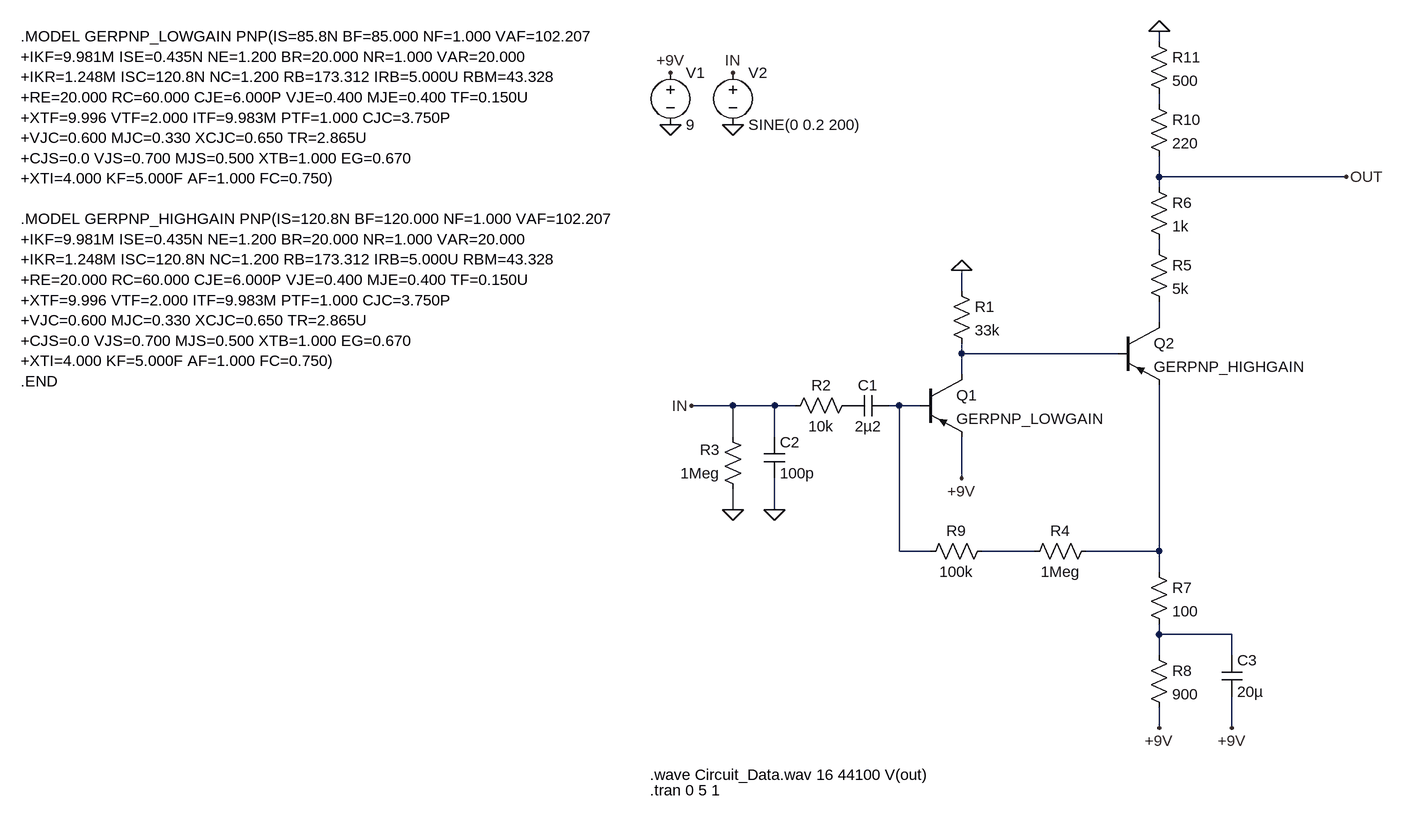
[diagram p0: schematic PNP_Fuzz_Simulation_wav_out.asc]
PNP_Fuzz_Simulation_wav_out.asc, the LTspice schematic file:
Version 4
SHEET 1 1636 1104
WIRE 496 -320 496 -336
WIRE 496 -224 496 -240
WIRE 496 -112 496 -144
WIRE 784 -112 496 -112
WIRE 496 -96 496 -112
WIRE 496 0 496 -16
WIRE 192 64 192 32
WIRE 496 112 496 80
WIRE 192 160 192 144
WIRE 432 160 192 160
WIRE 192 192 192 160
WIRE -160 240 -224 240
WIRE -96 240 -160 240
WIRE -64 240 -96 240
WIRE 96 240 80 240
WIRE 128 240 96 240
WIRE -160 288 -160 240
WIRE -96 288 -96 240
WIRE 192 352 192 288
WIRE -160 400 -160 368
WIRE -96 400 -96 352
WIRE 96 464 96 240
WIRE 144 464 96 464
WIRE 304 464 224 464
WIRE 496 464 496 208
WIRE 496 464 384 464
WIRE 496 496 496 464
WIRE 496 592 496 576
WIRE 608 592 496 592
WIRE 496 624 496 592
WIRE 608 624 608 592
WIRE 496 736 496 704
WIRE 608 736 608 688
FLAG 192 32 0
FLAG -224 240 IN
FLAG 192 352 +9V
FLAG -160 400 0
FLAG -256 -192 0
FLAG -160 -192 0
FLAG -256 -272 +9V
FLAG -160 -272 IN
FLAG -96 400 0
FLAG 496 736 +9V
FLAG 608 736 +9V
FLAG 784 -112 OUT
FLAG 496 -336 0
SYMBOL res 176 48 R0
SYMATTR InstName R1
SYMATTR Value 33k
SYMBOL res 32 224 R90
WINDOW 0 0 56 VBottom 2
WINDOW 3 32 56 VTop 2
SYMATTR InstName R2
SYMATTR Value 10k
SYMBOL res -144 384 R180
WINDOW 0 36 76 Left 2
WINDOW 3 36 40 Left 2
SYMATTR InstName R3
SYMATTR Value 1Meg
SYMBOL voltage -256 -288 R0
WINDOW 123 0 0 Left 0
WINDOW 39 0 0 Left 0
SYMATTR InstName V1
SYMATTR Value 9
SYMBOL voltage -160 -288 R0
WINDOW 123 0 0 Left 0
WINDOW 39 0 0 Left 0
SYMATTR InstName V2
SYMATTR Value SINE(0 0.2 200)
SYMBOL pnp 128 192 R0
SYMATTR InstName Q1
SYMATTR Value GERPNP_LOWGAIN
SYMBOL cap 80 224 R90
WINDOW 0 0 32 VBottom 2
WINDOW 3 32 32 VTop 2
SYMATTR InstName C1
SYMATTR Value 2µ2
SYMBOL cap -112 288 R0
SYMATTR InstName C2
SYMATTR Value 100p
SYMBOL res 400 448 R90
WINDOW 0 0 56 VBottom 2
WINDOW 3 32 56 VTop 2
SYMATTR InstName R4
SYMATTR Value 1Meg
SYMBOL res 480 -16 R0
SYMATTR InstName R5
SYMATTR Value 5k
SYMBOL res 480 -112 R0
SYMATTR InstName R6
SYMATTR Value 1k
SYMBOL res 480 480 R0
SYMATTR InstName R7
SYMATTR Value 100
SYMBOL res 480 608 R0
SYMATTR InstName R8
SYMATTR Value 900
SYMBOL cap 592 624 R0
SYMATTR InstName C3
SYMATTR Value 20µ
SYMBOL res 240 448 R90
WINDOW 0 0 56 VBottom 2
WINDOW 3 32 56 VTop 2
SYMATTR InstName R9
SYMATTR Value 100k
SYMBOL res 480 -240 R0
SYMATTR InstName R10
SYMATTR Value 220
SYMBOL res 480 -336 R0
SYMATTR InstName R11
SYMATTR Value 500
SYMBOL pnp 432 112 R0
SYMATTR InstName Q2
SYMATTR Value GERPNP_HIGHGAIN
TEXT -288 832 Left 2 !.tran 0 5 1
TEXT -288 808 Left 2 !.wave Circuit_Data.wav 16 44100 V(out)
TEXT -1256 -328 Left 2 !.MODEL GERPNP_LOWGAIN PNP(IS=85.8N BF=85.000 NF=1.000 VAF=102.207\n+IKF=9.981M ISE=0.435N NE=1.200 BR=20.000 NR=1.000 VAR=20.000\n+IKR=1.248M ISC=120.8N NC=1.200 RB=173.312 IRB=5.000U RBM=43.328\n+RE=20.000 RC=60.000 CJE=6.000P VJE=0.400 MJE=0.400 TF=0.150U\n+XTF=9.996 VTF=2.000 ITF=9.983M PTF=1.000 CJC=3.750P\n+VJC=0.600 MJC=0.330 XCJC=0.650 TR=2.865U\n+CJS=0.0 VJS=0.700 MJS=0.500 XTB=1.000 EG=0.670\n+XTI=4.000 KF=5.000F AF=1.000 FC=0.750)\n \n.MODEL GERPNP_HIGHGAIN PNP(IS=120.8N BF=120.000 NF=1.000 VAF=102.207\n+IKF=9.981M ISE=0.435N NE=1.200 BR=20.000 NR=1.000 VAR=20.000\n+IKR=1.248M ISC=120.8N NC=1.200 RB=173.312 IRB=5.000U RBM=43.328\n+RE=20.000 RC=60.000 CJE=6.000P VJE=0.400 MJE=0.400 TF=0.150U\n+XTF=9.996 VTF=2.000 ITF=9.983M PTF=1.000 CJC=3.750P\n+VJC=0.600 MJC=0.330 XCJC=0.650 TR=2.865U\n+CJS=0.0 VJS=0.700 MJS=0.500 XTB=1.000 EG=0.670\n+XTI=4.000 KF=5.000F AF=1.000 FC=0.750)\n.END

The netlist it stands for:
* PNP_Fuzz_Simulation_wav_out.asc
R1 0 N004 33k
R2 P001 IN 10k
R3 0 IN 1Meg
V1 +9V 0 9
V2 IN 0 SINE(0 0.2 200)
Q1 N004 N005 +9V 0 GERPNP_LOWGAIN
C1 N005 P001 2µ2
C2 IN 0 100p
R4 N007 N006 1Meg
R5 N002 N003 5k
R6 OUT N002 1k
R7 N007 N008 100
R8 N008 +9V 900
C3 N008 +9V 20µ
R9 N006 N005 100k
R10 N001 OUT 220
R11 0 N001 500
Q2 N003 N004 N007 0 GERPNP_HIGHGAIN
.model NPN NPN
.model PNP PNP
.lib standard.bjt
.tran 0 5 1
.wave Circuit_Data.wav 16 44100 V(out)
.MODEL GERPNP_LOWGAIN PNP(IS=85.8N BF=85.000 NF=1.000 VAF=102.207
+IKF=9.981M ISE=0.435N NE=1.200 BR=20.000 NR=1.000 VAR=20.000
+IKR=1.248M ISC=120.8N NC=1.200 RB=173.312 IRB=5.000U RBM=43.328
+RE=20.000 RC=60.000 CJE=6.000P VJE=0.400 MJE=0.400 TF=0.150U
+XTF=9.996 VTF=2.000 ITF=9.983M PTF=1.000 CJC=3.750P
+VJC=0.600 MJC=0.330 XCJC=0.650 TR=2.865U
+CJS=0.0 VJS=0.700 MJS=0.500 XTB=1.000 EG=0.670
+XTI=4.000 KF=5.000F AF=1.000 FC=0.750)
.MODEL GERPNP_HIGHGAIN PNP(IS=120.8N BF=120.000 NF=1.000 VAF=102.207
+IKF=9.981M ISE=0.435N NE=1.200 BR=20.000 NR=1.000 VAR=20.000
+IKR=1.248M ISC=120.8N NC=1.200 RB=173.312 IRB=5.000U RBM=43.328
+RE=20.000 RC=60.000 CJE=6.000P VJE=0.400 MJE=0.400 TF=0.150U
+XTF=9.996 VTF=2.000 ITF=9.983M PTF=1.000 CJC=3.750P
+VJC=0.600 MJC=0.330 XCJC=0.650 TR=2.865U
+CJS=0.0 VJS=0.700 MJS=0.500 XTB=1.000 EG=0.670
+XTI=4.000 KF=5.000F AF=1.000 FC=0.750)
.END
.backanno
.end